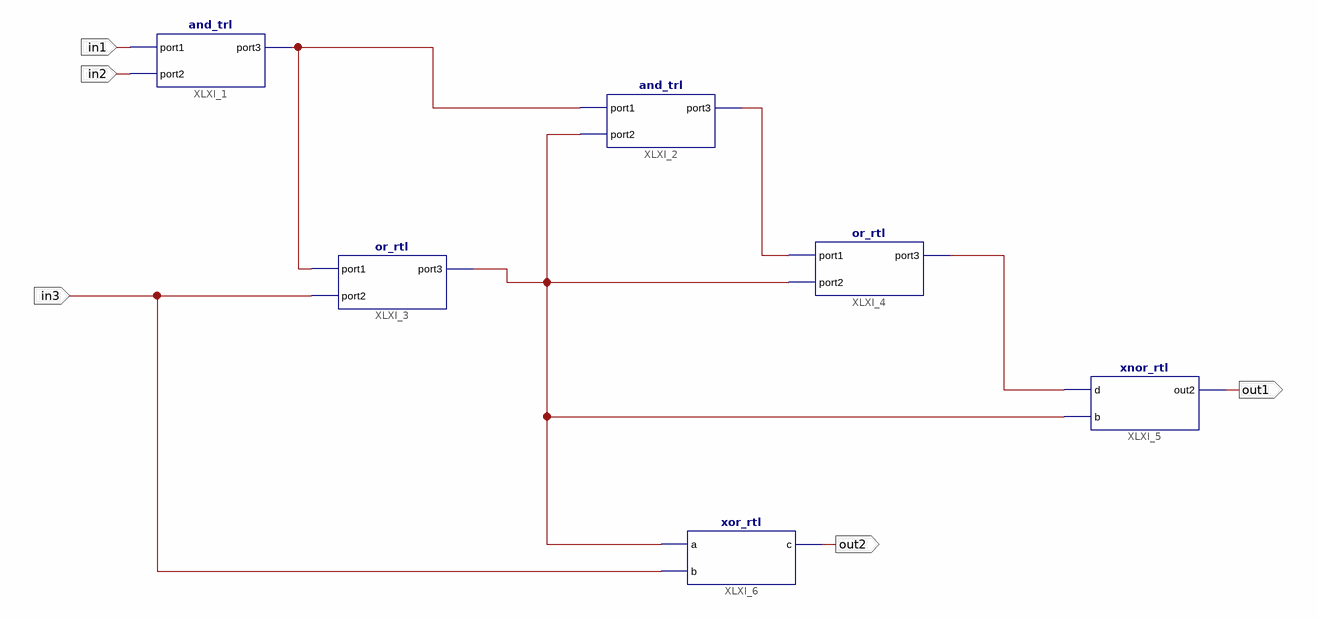
[diagram p0: schematic sheet 1]
// Xilinx ISE schematic circuit2_sch.sch (artix7) as structural Verilog: 6 symbols, 5 ports
module circuit2_sch (
  input  in3,
  input  in1,
  input  in2,
  output out1,
  output out2
);

  wire XLXN_2, XLXN_5, XLXN_7, XLXN_11;

  and_trl XLXI_1 (.port1(in1), .port2(in2), .port3(XLXN_2));
  and_trl XLXI_2 (.port1(XLXN_2), .port2(XLXN_11), .port3(XLXN_5));
  or_rtl XLXI_3 (.port1(XLXN_2), .port2(in3), .port3(XLXN_11));
  or_rtl XLXI_4 (.port1(XLXN_5), .port2(XLXN_11), .port3(XLXN_7));
  xnor_rtl XLXI_5 (.d(XLXN_7), .b(XLXN_11), .out2(out1));
  xor_rtl XLXI_6 (.a(XLXN_11), .b(in3), .c(out2));
endmodule
